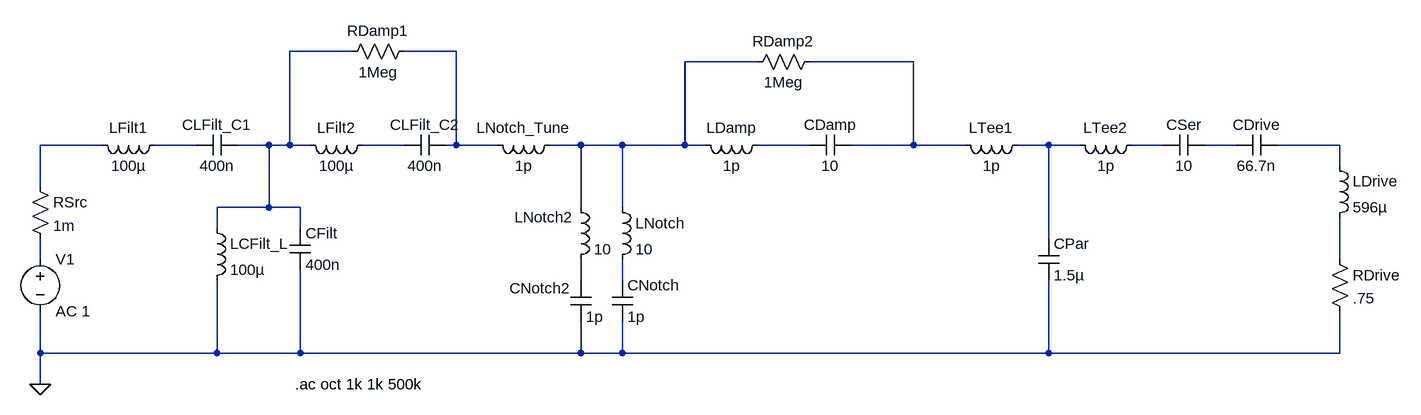
[diagram p0: schematic Filter_Archetype_Damped_2.asc]
Filter_Archetype_Damped_2.asc, the LTspice schematic file:
Version 4
SHEET 1 1972 680
WIRE 352 -80 256 -80
WIRE 512 -80 432 -80
WIRE 976 -64 864 -64
WIRE 1216 -64 1056 -64
WIRE -32 64 -128 64
WIRE 112 64 48 64
WIRE 224 64 176 64
WIRE 256 64 256 -80
WIRE 256 64 224 64
WIRE 288 64 256 64
WIRE 432 64 368 64
WIRE 512 64 512 -80
WIRE 512 64 496 64
WIRE 576 64 512 64
WIRE 704 64 656 64
WIRE 768 64 704 64
WIRE 864 64 864 -64
WIRE 864 64 768 64
WIRE 896 64 864 64
WIRE 1056 64 976 64
WIRE 1216 64 1216 -64
WIRE 1216 64 1120 64
WIRE 1296 64 1216 64
WIRE 1424 64 1376 64
WIRE 1472 64 1424 64
WIRE 1600 64 1552 64
WIRE 1712 64 1664 64
WIRE 1872 64 1776 64
WIRE 1872 96 1872 64
WIRE -128 128 -128 64
WIRE 224 160 224 64
WIRE 224 160 144 160
WIRE 272 160 224 160
WIRE 704 160 704 64
WIRE 768 160 768 64
WIRE 144 192 144 160
WIRE 272 192 272 160
WIRE 1424 208 1424 64
WIRE -128 240 -128 208
WIRE 1872 240 1872 176
WIRE 704 272 704 240
WIRE 768 272 768 240
WIRE -128 384 -128 320
WIRE 144 384 144 272
WIRE 144 384 -128 384
WIRE 272 384 272 256
WIRE 272 384 144 384
WIRE 704 384 704 336
WIRE 704 384 272 384
WIRE 768 384 768 336
WIRE 768 384 704 384
WIRE 1424 384 1424 272
WIRE 1424 384 768 384
WIRE 1872 384 1872 320
WIRE 1872 384 1424 384
WIRE -128 432 -128 384
FLAG -128 432 0
SYMBOL voltage -128 224 R0
WINDOW 123 0 0 Left 0
WINDOW 39 0 0 Left 0
SYMATTR InstName V1
SYMATTR Value AC 1
SYMBOL ind 64 48 R90
WINDOW 0 5 56 VBottom 2
WINDOW 3 32 56 VTop 2
SYMATTR InstName LFilt1
SYMATTR Value 100µ
SYMATTR SpiceLine Rser=100m
SYMBOL cap 176 48 R90
WINDOW 0 0 32 VBottom 2
WINDOW 3 32 32 VTop 2
SYMATTR InstName CLFilt_C1
SYMATTR Value 400n
SYMBOL res -144 112 R0
SYMATTR InstName RSrc
SYMATTR Value 1m
SYMBOL ind 384 48 R90
WINDOW 0 5 56 VBottom 2
WINDOW 3 32 56 VTop 2
SYMATTR InstName LFilt2
SYMATTR Value 100µ
SYMATTR SpiceLine Rser=100m
SYMBOL cap 496 48 R90
WINDOW 0 0 32 VBottom 2
WINDOW 3 32 32 VTop 2
SYMATTR InstName CLFilt_C2
SYMATTR Value 400n
SYMBOL ind 128 176 R0
SYMATTR InstName LCFilt_L
SYMATTR Value 100µ
SYMATTR SpiceLine Rser=100m
SYMBOL cap 256 192 R0
SYMATTR InstName CFilt
SYMATTR Value 400n
SYMBOL ind 752 144 R0
SYMATTR InstName LNotch
SYMATTR Value 10
SYMBOL cap 752 272 R0
SYMATTR InstName CNotch
SYMATTR Value 1p
SYMBOL ind 672 48 R90
WINDOW 0 5 56 VBottom 2
WINDOW 3 32 56 VTop 2
SYMATTR InstName LNotch_Tune
SYMATTR Value 1p
SYMBOL ind 1392 48 R90
WINDOW 0 5 56 VBottom 2
WINDOW 3 32 56 VTop 2
SYMATTR InstName LTee1
SYMATTR Value 1p
SYMBOL ind 1568 48 R90
WINDOW 0 5 56 VBottom 2
WINDOW 3 32 56 VTop 2
SYMATTR InstName LTee2
SYMATTR Value 1p
SYMBOL cap 1408 208 R0
SYMATTR InstName CPar
SYMATTR Value 1.5µ
SYMBOL cap 1664 48 R90
WINDOW 0 0 32 VBottom 2
WINDOW 3 32 32 VTop 2
SYMATTR InstName CSer
SYMATTR Value 10
SYMBOL cap 1776 48 R90
WINDOW 0 0 32 VBottom 2
WINDOW 3 32 32 VTop 2
SYMATTR InstName CDrive
SYMATTR Value 66.7n
SYMBOL ind 1856 80 R0
SYMATTR InstName LDrive
SYMATTR Value 596µ
SYMBOL res 1856 224 R0
SYMATTR InstName RDrive
SYMATTR Value .75
SYMBOL res 448 -96 R90
WINDOW 0 0 56 VBottom 2
WINDOW 3 32 56 VTop 2
SYMATTR InstName RDamp1
SYMATTR Value 1Meg
SYMBOL ind 992 48 R90
WINDOW 0 5 56 VBottom 2
WINDOW 3 32 56 VTop 2
SYMATTR InstName LDamp
SYMATTR Value 1p
SYMBOL cap 1120 48 R90
WINDOW 0 0 32 VBottom 2
WINDOW 3 32 32 VTop 2
SYMATTR InstName CDamp
SYMATTR Value 10
SYMBOL res 1072 -80 R90
WINDOW 0 0 56 VBottom 2
WINDOW 3 32 56 VTop 2
SYMATTR InstName RDamp2
SYMATTR Value 1Meg
SYMBOL ind 688 144 R0
WINDOW 0 -86 31 Left 2
SYMATTR InstName LNotch2
SYMATTR Value 10
SYMBOL cap 688 272 R0
WINDOW 0 -94 12 Left 2
SYMATTR InstName CNotch2
SYMATTR Value 1p
TEXT 264 432 Left 2 !.ac oct 1k 1k 500k

The netlist it stands for:
* Filter_Archetype_Damped_2.asc
V1 N013 0 AC 1
LFilt1 N006 N005 100µ Rser=100m
CLFilt_C1 N001 N006 400n
RSrc N005 N013 1m
LFilt2 N007 N001 100µ Rser=100m
CLFilt_C2 N002 N007 400n
LCFilt_L N001 0 100µ Rser=100m
CFilt N001 0 400n
LNotch N003 N016 10
CNotch N016 0 1p
LNotch_Tune N003 N002 1p
LTee1 N009 N004 1p
LTee2 N010 N009 1p
CPar N009 0 1.5µ
CSer N011 N010 10
CDrive N012 N011 66.7n
LDrive N012 N014 596µ
RDrive N014 0 .75
RDamp1 N002 N001 1Meg
LDamp N008 N003 1p
CDamp N004 N008 10
RDamp2 N004 N003 1Meg
LNotch2 N003 N015 10
CNotch2 N015 0 1p
.ac oct 1k 1k 500k
.backanno
.end